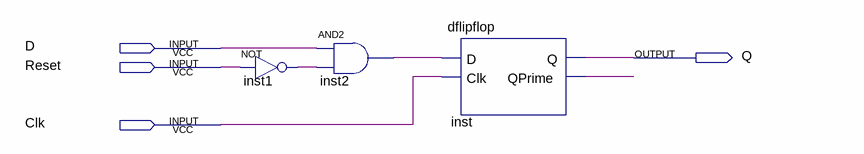
[diagram p0: schematic sheet]
// Quartus schematic resettabledflipflop.bdf as structural Verilog: 3 symbols, 4 pins
module resettabledflipflop (
  input  D,
  input  Reset,
  input  Clk,
  output Q
);

  wire inst1_out, inst2_out, inst_qprime;

  not inst1 (inst1_out, Reset);
  and inst2 (inst2_out, D, inst1_out);
  dflipflop inst (.D(inst2_out), .Clk(Clk), .Q(Q), .QPrime(inst_qprime));
endmodule
